# EAGLE design BMS Rev. 1 (EAGLE 7.6.0)
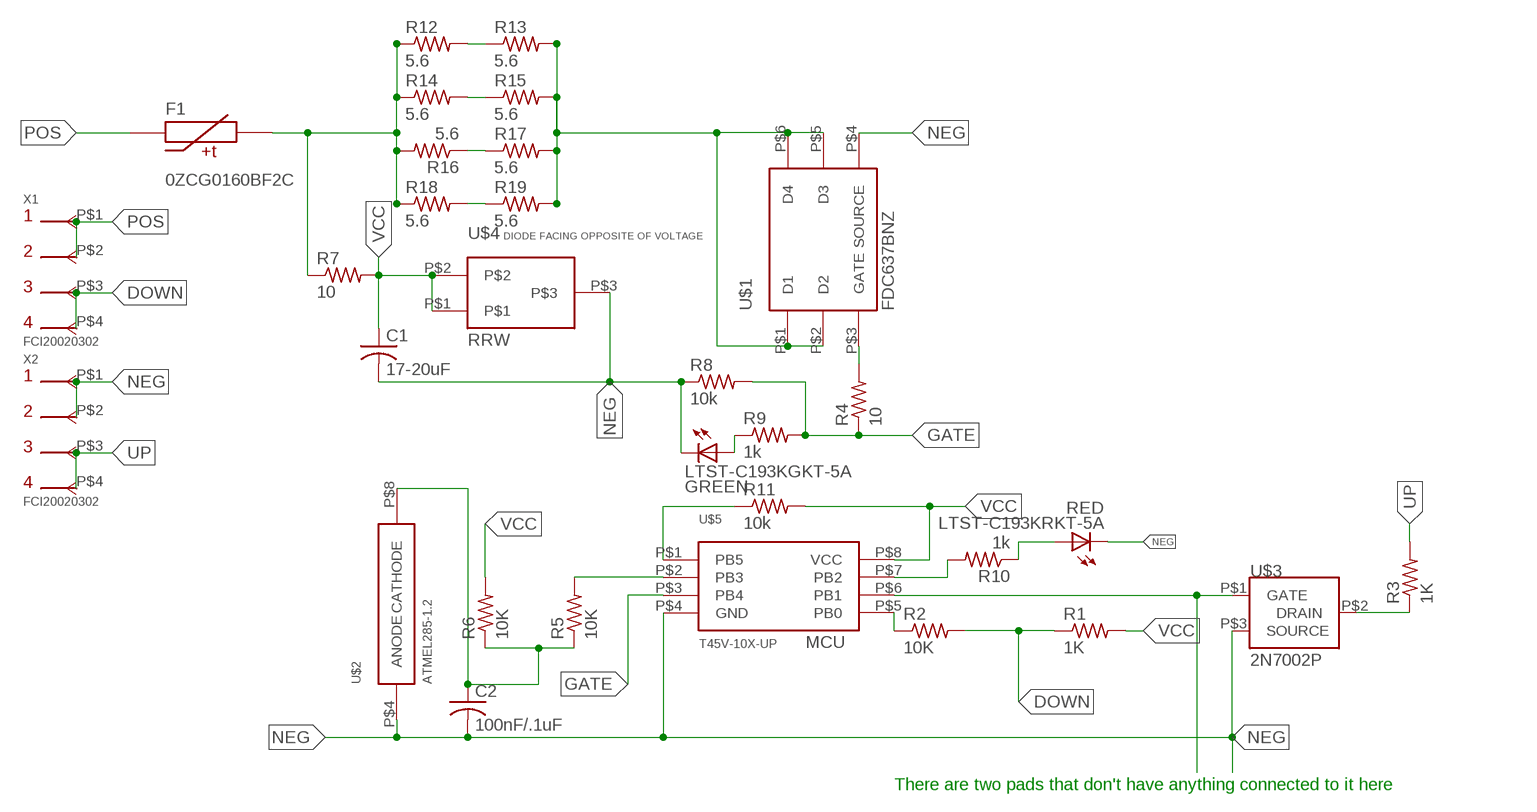
[diagram p0: schematic, sheet 1]

## Parts
C1  17-20uF  C-USC0805  [C0805]
C2  100nF/.1uF  C-USC0805  [C0805]
F1  0ZCG0160BF2C  [1812]
LTST-C193KGKT-5A  GREEN  LEDCHIPLED_1206  [CHIPLED_1206]
LTST-C193KRKT-5A  RED  LEDCHIPLED_1206  [CHIPLED_1206]
R1  1K  R-US_R0805  [R0805]
R2  10K  R-US_R0805  [R0805]
R3  1K  R-US_R0805  [R0805]
R4  10  R-US_R0805  [R0805]
R5  10K  R-US_R0805  [R0805]
R6  10K  R-US_R0805  [R0805]
R7  10  R-US_R0805  [R0805]
R8  10k  R-US_R0805  [R0805]
R9  1k  R-US_R0805  [R0805]
R10  1k  R-US_R0805  [R0805]
R11  10k  R-US_R0805  [R0805]
R12  5.6  R-US_R1206  [R1206]
R13  5.6  R-US_R1206  [R1206]
R14  5.6  R-US_R1206  [R1206]
R15  5.6  R-US_R1206  [R1206]
R16  5.6  R-US_R1206  [R1206]
R17  5.6  R-US_R1206  [R1206]
R18  5.6  R-US_R1206  [R1206]
R19  5.6  R-US_R1206  [R1206]
U$1  FDC637BNZ  [SOT-23-6]
U$2  ATMEL285-1.2  [8-SOIC]
U$3  2N7002P  [SOT23-3]
U$4  RRW  [SOT23-3]
U$5  T45V-10X-UP  [TSSOP-8(ATMEL)]
X1  FCI20020302  [2_PIN_AMPHENOL]
X2  FCI20020302  [2_PIN_AMPHENOL]

## Nets
DOWN: R1.1 R2.2 X1.P$3 X1.P$4
FUSE_OUT: F1.P$2 R7.1 R12.1 R14.1 R16.2 R18.1
GATE: R4.1 R8.2 R9.2 U$5.P$3(PB4)
MOSFET_IN: R13.2 R15.2 R17.2 R19.2 U$1.P$1(D1) U$1.P$2(D2) U$1.P$5(D3) U$1.P$6(D4)
N$1: C2.1 R5.1 R6.1 U$2.P$8(CATHODE)
N$2: R10.2 U$5.P$7(PB2)
N$3: R4.2 U$1.P$3(GATE)
N$4: R3.1 U$3.P$2(DRAIN)
N$5: R11.1 U$5.P$1(PB5)
N$6: R2.1 U$5.P$5(PB0)
N$7: R5.2 U$5.P$2(PB3)
N$8: LTST-C193KRKT-5A.A R10.1
N$9: R12.2 R13.1
N$10: R16.1 R17.1
N$11: LTST-C193KGKT-5A.A R9.1
N$12: R18.2 R19.1
N$14: R14.2 R15.1
N$15: U$3.P$1(GATE) U$5.P$6(PB1)
NEG: C1.2 C2.2 LTST-C193KGKT-5A.C LTST-C193KRKT-5A.C R8.1 U$1.P$4(SOURCE) U$2.P$4(ANODE) U$3.P$3(SOURCE) U$4.P$3 U$5.P$4(GND) X2.P$1 X2.P$2
POS: F1.P$1 X1.P$1 X1.P$2
UP: R3.2 X2.P$3 X2.P$4
VCC: C1.1 R1.2 R6.2 R7.2 R11.2 U$4.P$1 U$4.P$2 U$5.P$8(VCC)

## Notes on the sheet
- DIODE FACING OPPOSITE OF VOLTAGE
- MCU
- There are two pads that don't have anything connected to it here

## Library data of the parts
C1 C2 = resistor:C-US: CAPACITOR, American symbol
F1 = BMS Lbr:0ZCG0160BF2C
LTST-C193KGKT-5A LTST-C193KRKT-5A = led:LED: LED OSRAM: - CHIPLED LG R971, LG N971, LY N971, LG Q971, LY Q971, LO R971, LY R971 LH N974, LH R974 LS Q976, LO Q976, LY Q976 LO Q996 - Hyper CHIPLED LW Q18S LB Q993, LB Q99A, LB R99A - SideLED LS A670, LO A670, LY A670, LG A670, LP A670 LB A673, LV A673, LT A673, LW A673 LH A674 LY A675 LS A676, LA A676, LO A676, LY A676, LW A676 LS A679, LY A679, LG A679 - Hyper Micro SIDELED® LS Y876, LA Y876, LO Y876, LY Y876 LT Y87S - SmartLED LW L88C, LW L88S LB L89C, LB L89S, LG L890 LS L89K, LO L89K, LY L89K LS L896, LA L896, LO L896, LY L896 - TOPLED LS T670, LO T670, LY T670, LG T670, LP T670 LSG T670, LSP T670, LSY T670, LOP T670, LYG T670 LG T671, LOG T671, LSG T671 LB T673, LV T673, LT T673, LW T673 LH T674 LS T676, LA T676, LO T676, LY T676, LB T676, LH T676, LSB T676, LW T676 LB T67C, LV T67C, LT T67C, LS T67K, LO T67K, LY T67K, LW E67C LS E67B, LA E67B, LO E67B, LY E67B, LB E67C, LV E67C, LT E67C LW T67C LS T679, LY T679, LG T679 LS T770, LO T770, LY T770, LG T770, LP T770 LB T773, LV T773, LT T773, LW T773 LH T774 LS E675, LA E675, LY E675, LS T675 LS T776, LA T776, LO T776, LY T776, LB T776 LHGB T686 LT T68C, LB T68C - Hyper Mini TOPLED® LB M676 - Mini TOPLED Santana® LG M470 LS M47K, LO M47K, LY M47K Source: http://www.osram.convergy.de LUXEON: - LUMILED® LXK2-PW12-R00, LXK2-PW12-S00, LXK2-PW14-U00, LXK2-PW14-V00 LXK2-PM12-R00, LXK2-PM12-S00, LXK2-PM14-U00 LXK2-PE12-Q00, LXK2-PE12-R00, LXK2-PE12-S00, LXK2-PE14-T00, LXK2-PE14-U00 LXK2-PB12-K00, LXK2-PB12-L00, LXK2-PB12-M00, LXK2-PB14-N00, LXK2-PB14-P00, LXK2-PB14-Q00 LXK2-PR12-L00, LXK2-PR12-M00, LXK2-PR14-Q00, LXK2-PR14-R00 LXK2-PD12-Q00, LXK2-PD12-R00, LXK2-PD12-S00 LXK2-PH12-R00, LXK2-PH12-S00 LXK2-PL12-P00, LXK2-PL12-Q00, LXK2-PL12-R00 Source: www.luxeon.com KINGBRIGHT: KA-3528ASYC Source: www.kingbright.com
R1-R11 = resistor:R-US_: RESISTOR, American symbol
R12-R19 = adafruit:R-US_: RESISTOR, American symbol
U$1 = BMS Lbr:FDC637BNZ: Logic Level N-Channel MOSFET for controlling balancing
U$2 = BMS Lbr:ATMEL285-1.2: LM285-1.2 IC This is a 1.235 volt reference IC. Other ICs can be used that are of different package sizes; OC_NEWARK: unknown
U$3 = BMS Lbr:2N7002P: Low Current, Logic Level, N-Channel Mosfet
U$4 = BMS Lbr:RRW; OC_NEWARK: unknown
U$5 = BMS Lbr:T45V-10X-UP: Suspected to be the ATtiny45V microcontroller based off of pinout and connection to programming pins; OC_NEWARK: unknown
X1 X2 = BMS Lbr:FCI20020302: 2 Pin Connector Veritcal Mount

## Board
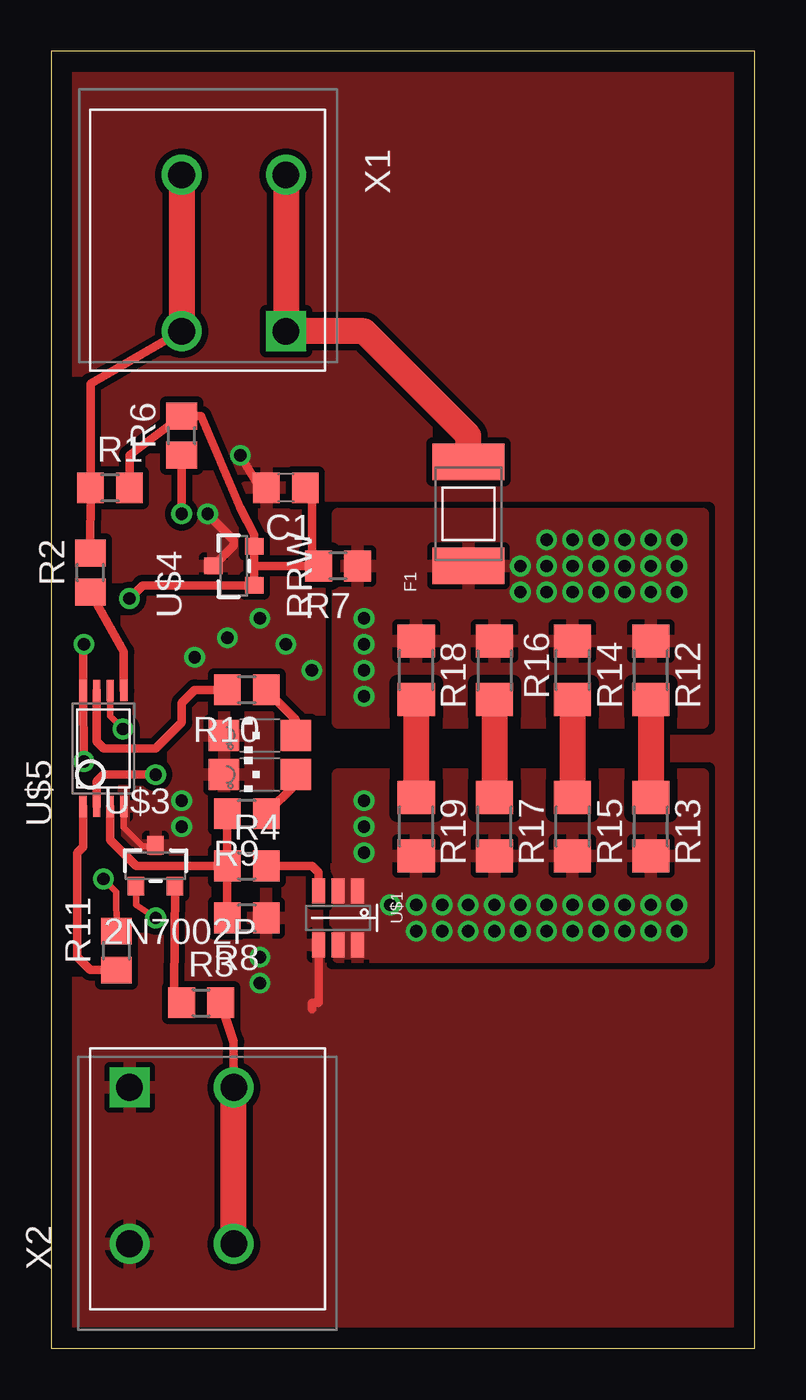
[diagram p1: board, top side]
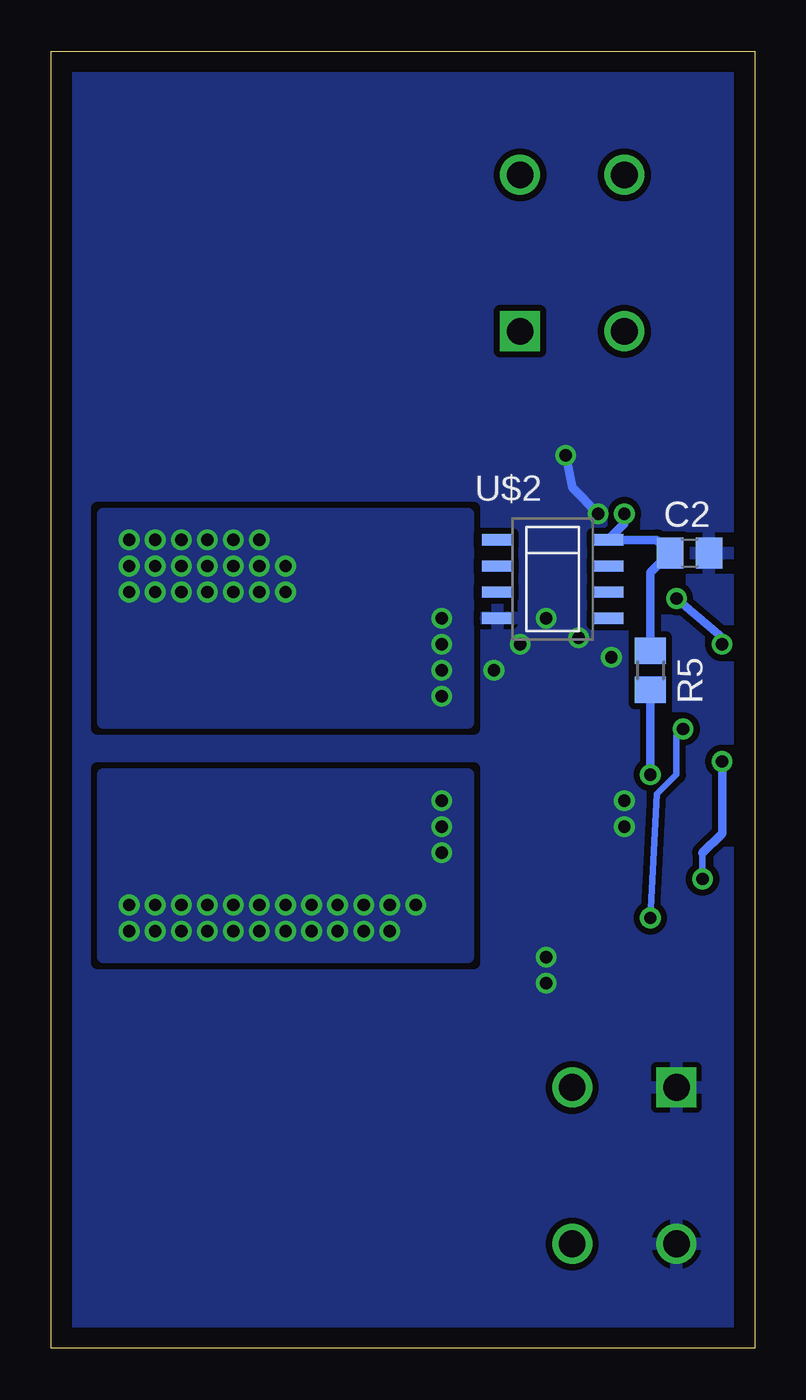
[diagram p2: board, bottom side, seen from below]

Size 34.27 x 63.17 mm. Coordinates in mm from the lower left corner, seen from the top.
Outline: 0,0 34.27,0 34.27,63.17 0,63.17 0,0
Copper layers (1*16): Top 0.035mm / dielectric 1.5mm / Bottom 0.035mm
Design rules "default": minimum track width 10mil, minimum drill 24mil, track to track 8mil, track to pad 8mil, pad to pad 8mil, via to via 8mil, smd to smd 8mil, copper to edge 40mil, drill to drill 8mil, minimum pad ring 10mil, minimum via ring 8mil, stop-mask expansion 4mil, vias tented up to drill 0mil, thermal gap 10mil

### Footprints (pad centres in the part's own frame; a part is rotated, then mirrored left to right if it is on the bottom)
C0805 = smd 1.3 x 1.5: 1 -0.95,0; 2 0.95,0
1812 = smd 1.778 x 3.505: P$1 2.54,0; P$2 -2.54,0
CHIPLED_1206 = smd 1.5 x 1.5: A 0,-1.75; C 0,1.75
R0805 = smd 1.3 x 1.5: 1 -0.95,0; 2 0.95,0
R1206 = smd 1.6 x 1.803: 1 -1.422,0; 2 1.422,0
SOT-23-6 = smd 0.62 x 1.22: P$1 -0.95,-1.31; P$2 0,-1.31; P$3 0.95,-1.31; P$4 0.95,1.31; P$5 0,1.31; P$6 -0.95,1.31
8-SOIC = smd 1.5 x 0.55: P$1 -2.7,1.905; P$2 -2.7,0.635; P$3 -2.7,-0.635; P$4 -2.7,-1.905; P$5 2.7,-1.905; P$6 2.7,-0.635; P$7 2.7,0.635; P$8 2.7,1.905
SOT23-3 = smd 0.8 x 0.9: P$1 -0.95,-1; P$2 0.95,-1; P$3 0,1
TSSOP-8(ATMEL) = smd 1.016 x 0.356: P$1 -2.82,0.992; P$2 -2.82,0.331; P$3 -2.82,-0.331; P$4 -2.82,-0.992; P$5 2.82,-0.992; P$6 2.82,-0.331; P$7 2.82,0.331; P$8 2.82,0.992
2_PIN_AMPHENOL = drill 1.3 square: P$1 0,0 | drill 1.3: P$2 0,-7.62; P$3 5.08,0; P$4 5.08,-7.62

### Placement (x,y rotation side)
C1  11.43,41.91 180 top
C2  3.17,38.73 0 bottom
F1  20.32,40.64 90 top
LTST-C193KGKT-5A  10.16,27.94 90 top
LTST-C193KRKT-5A  10.16,29.84 90 top
R1  2.86,41.91 0 top
R2  1.91,37.78 90 top
R3  7.3,16.83 0 top
R4  9.53,23.5 0 top
R5  5.08,33.02 270 bottom
R6  6.35,44.45 90 top
R7  13.97,38.1 180 top
R8  9.53,20.95 180 top
R9  9.53,26.04 180 top
R10  9.53,32.07 180 top
R11  3.17,19.37 90 top
R12  29.21,33.02 270 top
R13  29.21,25.4 270 top
R14  25.4,33.02 270 top
R15  25.4,25.4 270 top
R16  21.59,33.02 90 top
R17  21.59,25.4 270 top
R18  17.78,33.02 270 top
R19  17.78,25.4 270 top
U$1  13.97,20.95 180 top
U$2  9.84,37.47 0 bottom
U$3  5.08,23.5 0 top
U$4  8.89,38.1 90 top
U$5  2.54,29.21 90 top
X1  11.43,49.53 180 top
X2  3.81,12.7 0 top

### Tracks (layer width: path | path; a pad name or v marks a point on that pad's centre or on a via)
DOWN
  Top 0.406: R2.2 R1.1 1.91,46.99 X1.P$3
  Top 1.27: X1.P$4 X1.P$3
FUSE_OUT  (via drill 0.6)
  other vias: 27.94,38.1 27.94,36.83 29.21,36.83 26.67,38.1 26.67,36.83 30.48,36.83 25.4,38.1 25.4,36.83 29.21,38.1 30.48,38.1 22.86,36.83 24.13,36.83 24.13,38.1 26.67,39.37 25.4,39.37 22.86,38.1 30.48,39.37 24.13,39.37 27.94,39.37 29.21,39.37 15.24,31.75 15.24,33.02 15.24,34.29 15.24,35.56
  pour Top (isolate 0.406): 31.75,40.64 13.97,40.64 13.97,30.48 31.75,30.48
  pour Bottom (isolate 0.406): 13.97,40.64 13.97,30.48 31.75,30.48 31.75,40.64
GATE
  Top 0.406: U$5.P$3 2.87,24.75 4.13,23.5 R4.1 | R8.2 R4.1 | R4.1 R9.2
MOSFET_IN  (via drill 0.6)
  other vias: 30.48,21.59 30.48,20.32 29.21,20.32 29.21,21.59 27.94,21.59 27.94,20.32 26.67,21.59 21.59,21.59 20.32,21.59 20.32,20.32 19.05,21.59 17.78,21.59 16.51,21.59 17.78,20.32 19.05,20.32 15.24,24.13 15.24,25.4 15.24,26.67 21.59,20.32 22.86,20.32 22.86,21.59 24.13,21.59 25.4,21.59 25.4,20.32 26.67,20.32 24.13,20.32
  pour Top (isolate 0.406, no thermals): 13.65,23.5 13.65,19.05 16.19,19.05 16.19,23.5
  pour Bottom (isolate 0.406): 13.97,27.94 13.97,19.05 31.75,19.05 31.75,27.94
  pour Top (isolate 0.406, rank 2): 31.75,27.94 31.75,19.05 13.97,19.05 13.97,27.94
N$1  (via drill 0.6)
  Top 0.406: R6.1 v6.35,40.64
  Bottom 0.406: v6.35,40.64 6.35,40.16 U$2.P$8 4.76,39.37 C2.1 5.08,37.78 R5.1
N$2
  Top 0.406: U$5.P$7 2.21,29.54 2.54,29.21 5.08,29.21 6.35,30.48 6.35,31.43 6.99,32.07 R10.2
N$3
  Top 0.406: U$1.P$3 13.02,23.18 12.7,23.5 R4.2
N$4
  Top 0.406: R3.1 5.99,17.51 U$3.P$2
N$5
  Top 0.406: R11.1 1.9,18.42 1.27,19.05 1.27,24.13 1.55,24.41 U$5.P$1
N$6
  Top 0.406: U$5.P$5 3.53,33.93 R2.1
N$7  (via drill 0.6)
  Top 0.406: U$5.P$2 2.21,27.61 2.54,27.94 v5.08,27.94
  Bottom 0.406: R5.2 v5.08,27.94
N$8
  Top 0.406: R10.1 11.91,30.63 LTST-C193KRKT-5A.A
N$9
  Top 1.27: R12.2 R13.1
N$10
  Top 1.27: R16.1 R17.1
N$11
  Top 0.406: R9.1 11.91,27.47 LTST-C193KGKT-5A.A
N$12
  Top 1.27: R18.2 R19.1
N$14
  Top 1.27: R14.2 R15.1
N$15  (via drill 0.6)
  Top 0.305: U$3.P$1 4.13,21.59 v5.08,20.95 | v3.49,30.16 2.87,30.79 U$5.P$6
  Bottom 0.305: v5.08,20.95 4.76,26.99 3.81,27.94 3.81,29.84 v3.49,30.16
NEG  (via drill 0.6)
  Top 0.305: U$5.P$4 3.53,25.36 4.45,24.45 5.03,24.45 U$3.P$3
  Top 0.406: U$4.P$3 8.89,39.1 8.89,39.37 v7.62,40.64 | v9.21,43.5 10.16,41.91 C1.2 | U$1.P$4 13.02,16.83 12.7,16.83 12.7,16.51
  Bottom 0.406: v7.62,40.64 8.89,41.91 v9.21,43.5
  other vias: 6.35,26.67 6.35,25.4 10.16,19.05 10.16,17.78 6.99,33.66 8.57,34.61 10.16,35.56 11.43,34.29 12.7,33.02
  pour Bottom (isolate 0.305, rank 6): 0,0 34.29,0 34.29,63.5 0,63.5
  pour Top (isolate 0.305, rank 6): 0,0 34.29,0 34.29,63.5 0,63.5
POS
  Top 1.27: X1.P$2 X1.P$1 15.24,49.53 20.32,44.45 F1.P$1
UP
  Top 0.406: X2.P$3 8.89,14.92 R3.2
  Top 1.27: X2.P$4 X2.P$3
VCC  (via drill 0.6)
  Top 0.305: v2.54,22.86 3.17,22.23 R11.2
  Top 0.406: 9.89,38.1 U$4.P$1 4.45,37.15 v3.81,36.51 | 9.89,38.1 U$4.P$2 9.89,39.64 9.21,40.96 7.3,45.4 R6.2 3.81,43.49 R1.2 | 12.7,38.1 9.89,38.1 | C1.1 12.7,41.59 12.7,38.1 | 12.7,38.1 R7.2 | v1.59,28.57 U$5.P$8 1.55,34.25 v1.59,34.29
  Bottom 0.305: 2.54,24.13 v2.54,22.86
  Bottom 0.406: v1.59,28.57 1.59,25.08 2.54,24.13 | v3.81,36.51 1.59,34.61 v1.59,34.29